# Altium schematic sheet S7CAS-PLEIADES-CARTE-MERE_P06_FPGA4.SCHDOC
size Tabloid; SheetNumber: 9; SheetTotal: 18; Sheet_Name: FPGA4; Size: 11x17
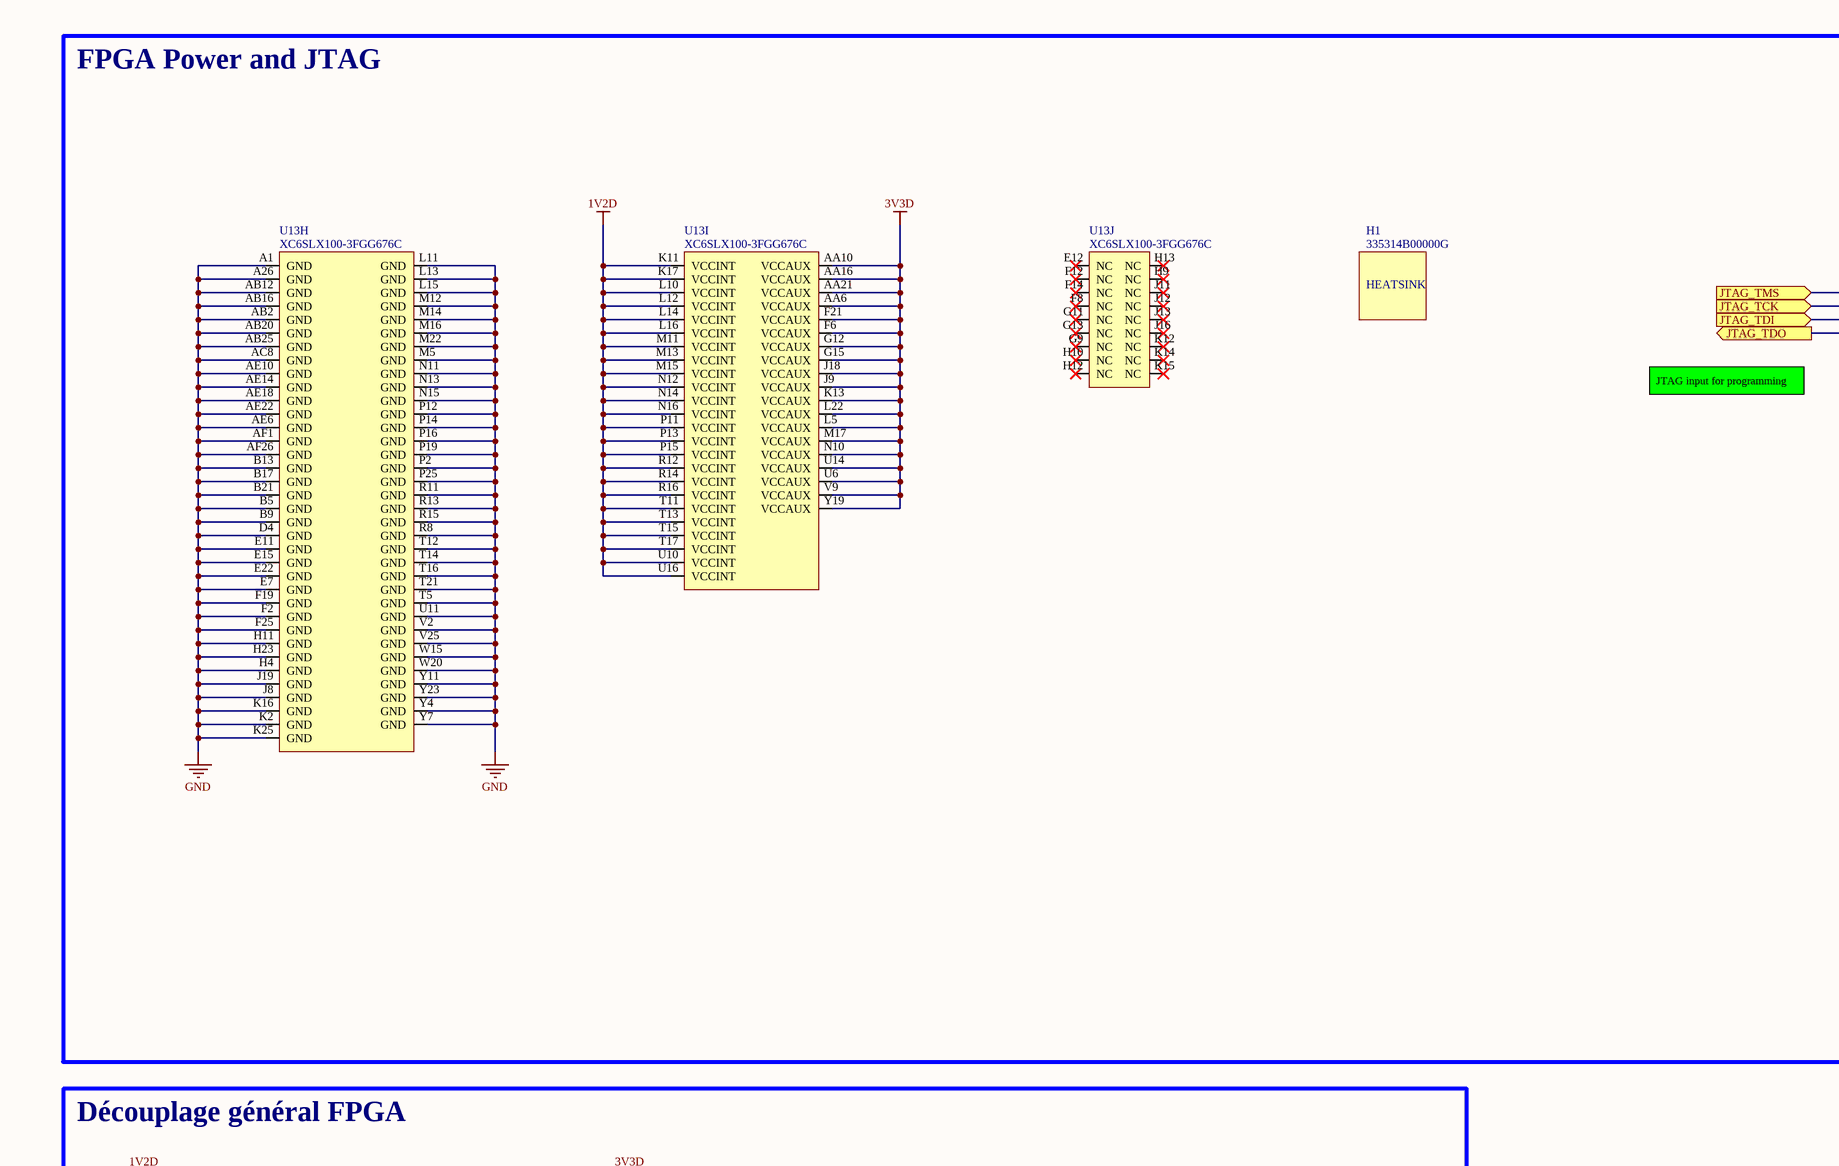
[diagram p0: S7CAS-PLEIADES-CARTE-MERE_P06_FPGA4.SCHDOC, top left]
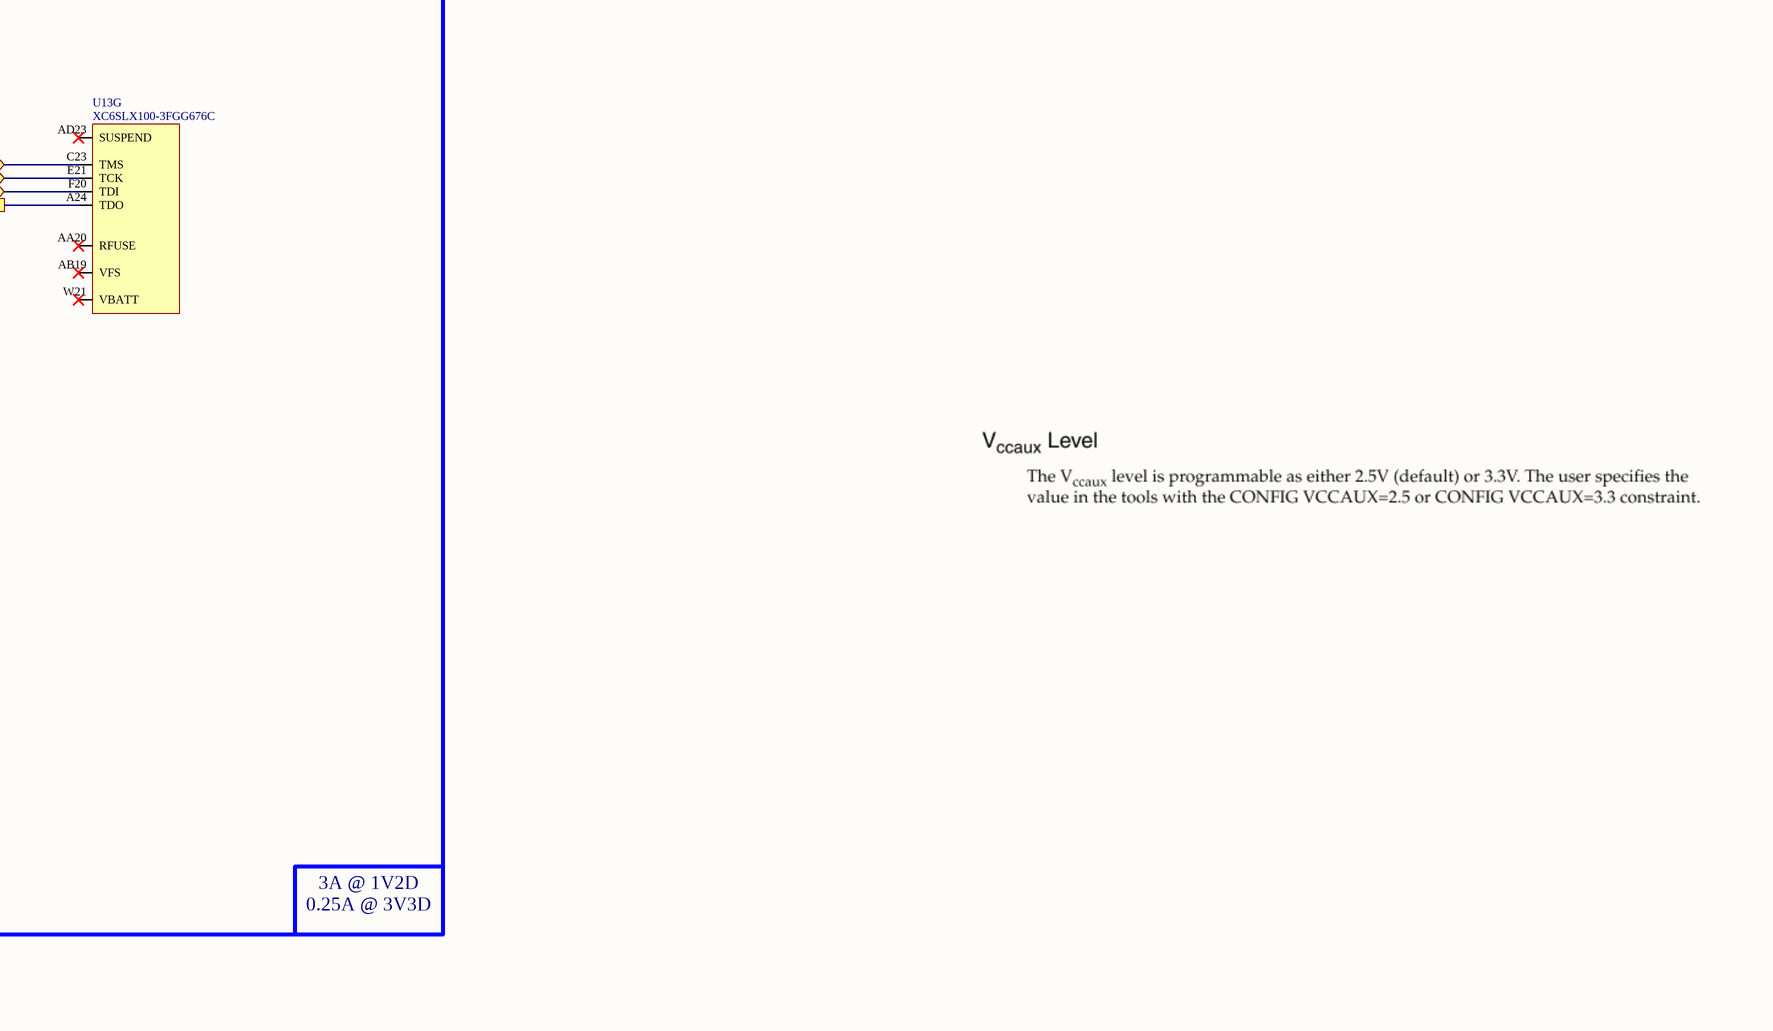
[diagram p1: S7CAS-PLEIADES-CARTE-MERE_P06_FPGA4.SCHDOC, top right]
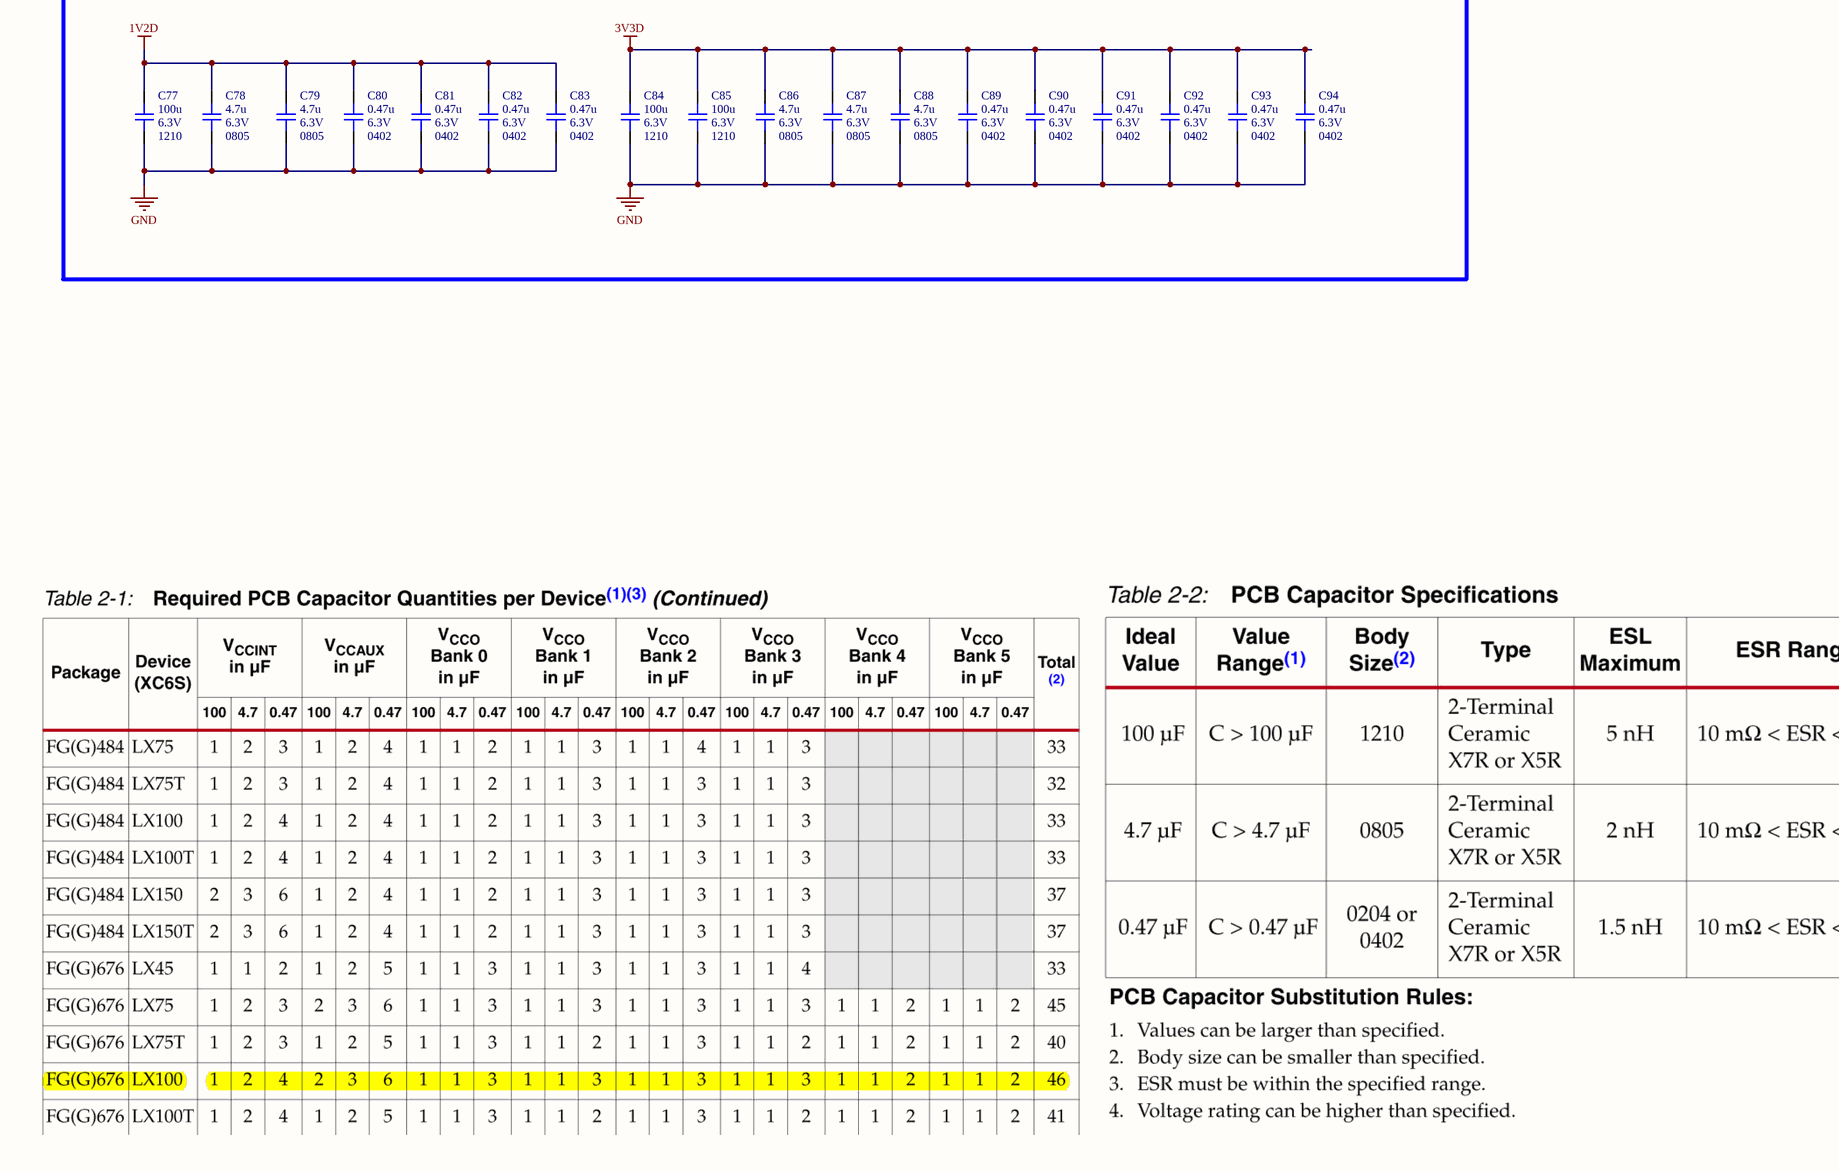
[diagram p2: S7CAS-PLEIADES-CARTE-MERE_P06_FPGA4.SCHDOC, bottom left]
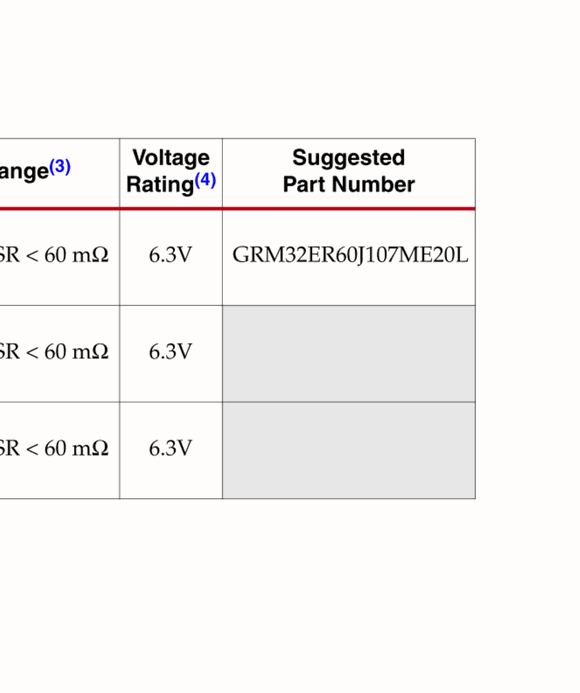
[diagram p3: S7CAS-PLEIADES-CARTE-MERE_P06_FPGA4.SCHDOC, bottom right]

## Parts
C77  value 100u  Voltage: 6.3V  Package: 1210  [CAP_1210]  (hidden comment: CAP - 1210)
C78  value 4.7u  Voltage: 6.3V  Package: 0805  [CAP_0805]  (hidden comment: CAP - 0805)
C79  value 4.7u  Voltage: 6.3V  Package: 0805  [CAP_0805]  (hidden comment: CAP - 0805)
C80  value 0.47u  Voltage: 6.3V  Package: 0402  [CAP_0402]  (hidden comment: CAP - 0402)
C81  value 0.47u  Voltage: 6.3V  Package: 0402  [CAP_0402]  (hidden comment: CAP - 0402)
C82  value 0.47u  Voltage: 6.3V  Package: 0402  [CAP_0402]  (hidden comment: CAP - 0402)
C83  value 0.47u  Voltage: 6.3V  Package: 0402  [CAP_0402]  (hidden comment: CAP - 0402)
C84  value 100u  Voltage: 6.3V  Package: 1210  [CAP_1210]  (hidden comment: CAP - 1210)
C85  value 100u  Voltage: 6.3V  Package: 1210  [CAP_1210]  (hidden comment: CAP - 1210)
C86  value 4.7u  Voltage: 6.3V  Package: 0805  [CAP_0805]  (hidden comment: CAP - 0805)
C87  value 4.7u  Voltage: 6.3V  Package: 0805  [CAP_0805]  (hidden comment: CAP - 0805)
C88  value 4.7u  Voltage: 6.3V  Package: 0805  [CAP_0805]  (hidden comment: CAP - 0805)
C89  value 0.47u  Voltage: 6.3V  Package: 0402  [CAP_0402]  (hidden comment: CAP - 0402)
C90  value 0.47u  Voltage: 6.3V  Package: 0402  [CAP_0402]  (hidden comment: CAP - 0402)
C91  value 0.47u  Voltage: 6.3V  Package: 0402  [CAP_0402]  (hidden comment: CAP - 0402)
C92  value 0.47u  Voltage: 6.3V  Package: 0402  [CAP_0402]  (hidden comment: CAP - 0402)
C93  value 0.47u  Voltage: 6.3V  Package: 0402  [CAP_0402]  (hidden comment: CAP - 0402)
C94  value 0.47u  Voltage: 6.3V  Package: 0402  [CAP_0402]  (hidden comment: CAP - 0402)
H1  335314B00000G
U13  XC6SLX100-3FGG676C  [FPGA_XILINX_FGG676]  (parts G,H,I,J of 10)

## Blocks framed on the sheet
FPGA Power and JTAG: H1 U13
Découplage général FPGA: C77-C94

## Ports
JTAG_TCK (in, see S7CAS-PLEIADES-CARTE-MERE_P06_USB_PROGRAMER[6B]), JTAG_TDI (in, see S7CAS-PLEIADES-CARTE-MERE_P06_USB_PROGRAMER[6B]), JTAG_TDO (out, see S7CAS-PLEIADES-CARTE-MERE_P06_USB_PROGRAMER[6B]), JTAG_TMS (in, see S7CAS-PLEIADES-CARTE-MERE_P06_USB_PROGRAMER[6B])

## Nets
1V2D: C77.2 C78.2 C79.2 C80.2 C81.2 C82.2 C83.2 U13.K11(VCCINT) U13.K17(VCCINT) U13.L10(VCCINT) U13.L12(VCCINT) U13.L14(VCCINT) U13.L16(VCCINT) U13.M11(VCCINT) U13.M13(VCCINT) U13.M15(VCCINT) U13.N12(VCCINT) U13.N14(VCCINT) U13.N16(VCCINT) U13.P11(VCCINT) U13.P13(VCCINT) U13.P15(VCCINT) U13.R12(VCCINT) U13.R14(VCCINT) U13.R16(VCCINT) U13.T11(VCCINT) U13.T13(VCCINT) U13.T15(VCCINT) U13.T17(VCCINT) U13.U10(VCCINT) U13.U16(VCCINT)
3V3D: C84.2 C85.2 C86.2 C87.2 C88.2 C89.2 C90.2 C91.2 C92.2 C93.2 C94.2 U13.AA6(VCCAUX) U13.AA10(VCCAUX) U13.AA16(VCCAUX) U13.AA21(VCCAUX) U13.F6(VCCAUX) U13.F21(VCCAUX) U13.G12(VCCAUX) U13.G15(VCCAUX) U13.J9(VCCAUX) U13.J18(VCCAUX) U13.K13(VCCAUX) U13.L5(VCCAUX) U13.L22(VCCAUX) U13.M17(VCCAUX) U13.N10(VCCAUX) U13.U6(VCCAUX) U13.U14(VCCAUX) U13.V9(VCCAUX) U13.Y19(VCCAUX)
GND: C77.1 C78.1 C79.1 C80.1 C81.1 C82.1 C83.1 C84.1 C85.1 C86.1 C87.1 C88.1 C89.1 C90.1 C91.1 C92.1 C93.1 C94.1 U13.A1(GND) U13.A26(GND) U13.AB2(GND) U13.AB12(GND) U13.AB16(GND) U13.AB20(GND) U13.AB25(GND) U13.AC8(GND) U13.AE6(GND) U13.AE10(GND) U13.AE14(GND) U13.AE18(GND) U13.AE22(GND) U13.AF1(GND) U13.AF26(GND) U13.B5(GND) U13.B9(GND) U13.B13(GND) U13.B17(GND) U13.B21(GND) U13.D4(GND) U13.E7(GND) U13.E11(GND) U13.E15(GND) U13.E22(GND) U13.F2(GND) U13.F19(GND) U13.F25(GND) U13.H4(GND) U13.H11(GND) U13.H23(GND) U13.J8(GND) U13.J19(GND) U13.K2(GND) U13.K16(GND) U13.K25(GND) U13.L11(GND) U13.L13(GND) U13.L15(GND) U13.M5(GND) U13.M12(GND) U13.M14(GND) U13.M16(GND) U13.M22(GND) U13.N11(GND) U13.N13(GND) U13.N15(GND) U13.P2(GND) U13.P12(GND) U13.P14(GND) U13.P16(GND) U13.P19(GND) U13.P25(GND) U13.R8(GND) U13.R11(GND) U13.R13(GND) U13.R15(GND) U13.T5(GND) U13.T12(GND) U13.T14(GND) U13.T16(GND) U13.T21(GND) U13.U11(GND) U13.V2(GND) U13.V25(GND) U13.W15(GND) U13.W20(GND) U13.Y4(GND) U13.Y7(GND) U13.Y11(GND) U13.Y23(GND)
JTAG_TCK: U13.E21(TCK) ; port JTAG_TCK
JTAG_TDI: U13.F20(TDI) ; port JTAG_TDI
JTAG_TDO: U13.A24(TDO) ; port JTAG_TDO
JTAG_TMS: U13.C23(TMS) ; port JTAG_TMS

Not connected (* = marked no-connect by the designer): U13 AA20(RFUSE)* AB19(VFS)* AD23(SUSPEND)* E12(NC)* F8(NC)* F12(NC)* F14(NC)* G9(NC)* G11(NC)* G13(NC)* H9(NC)* H10(NC)* H12(NC)* H13(NC)* J11(NC)* J12(NC)* J13(NC)* J16(NC)* K12(NC)* K14(NC)* K15(NC)* W21(VBATT)*

## Notes on the sheet
- JTAG input for programming
- 3A @ 1V2D
  0.25A @ 3V3D
- Sheet Name
- Project Title
- Global Project
- Size
- Group
- Revision
- Date
- Sheet
- of
- Filename
- Designers
- (in symbol HSK_335314B00000G) HEATSINK

## Library data of the parts
C77 C84 C85 = CAP - 1210: Precision: 10%; Current: *; CreatedBy: Jonathan Bouchard; Power: *
C78 C79 C86-C88 = CAP - 0805: Precision: 10%; Current: *; CreatedBy: Jonathan Bouchard; Power: *
C80-C83 C89-C94 = CAP - 0402: Precision: 10%; Current: *; CreatedBy: Jonathan Bouchard; Power: *
H1 = HSK_335314B00000G: HSK - Heat sink 335314B00000G 27x27mm; GRAMS Lib Spec: 2.7
U13 = FPGA_XC6SLX100-3FGG676C: FPGA - XILINX SPARTAN 6 480 I/O - BGA-676; Voltage: 1.14 V ~ 1.26 V; Current: *; Power: *; Mfg: Xilinx; Mfg Part Number: XC6SLX100-3FGG676C; HelpURL: https://www.xilinx.com/support/documentation/data_sheets/ds162.pdf; CreatedBy: Jonathan Bouchard; Temperature: 0°C ~ 85°C (TJ); Value: *; Precision: *; Package: BGA-676; Supplier 1: Digikey; Supplier Part Number 1: 122-1760-ND